# Altium schematic sheet VFD_13ST84GINK.SchDoc
size A3
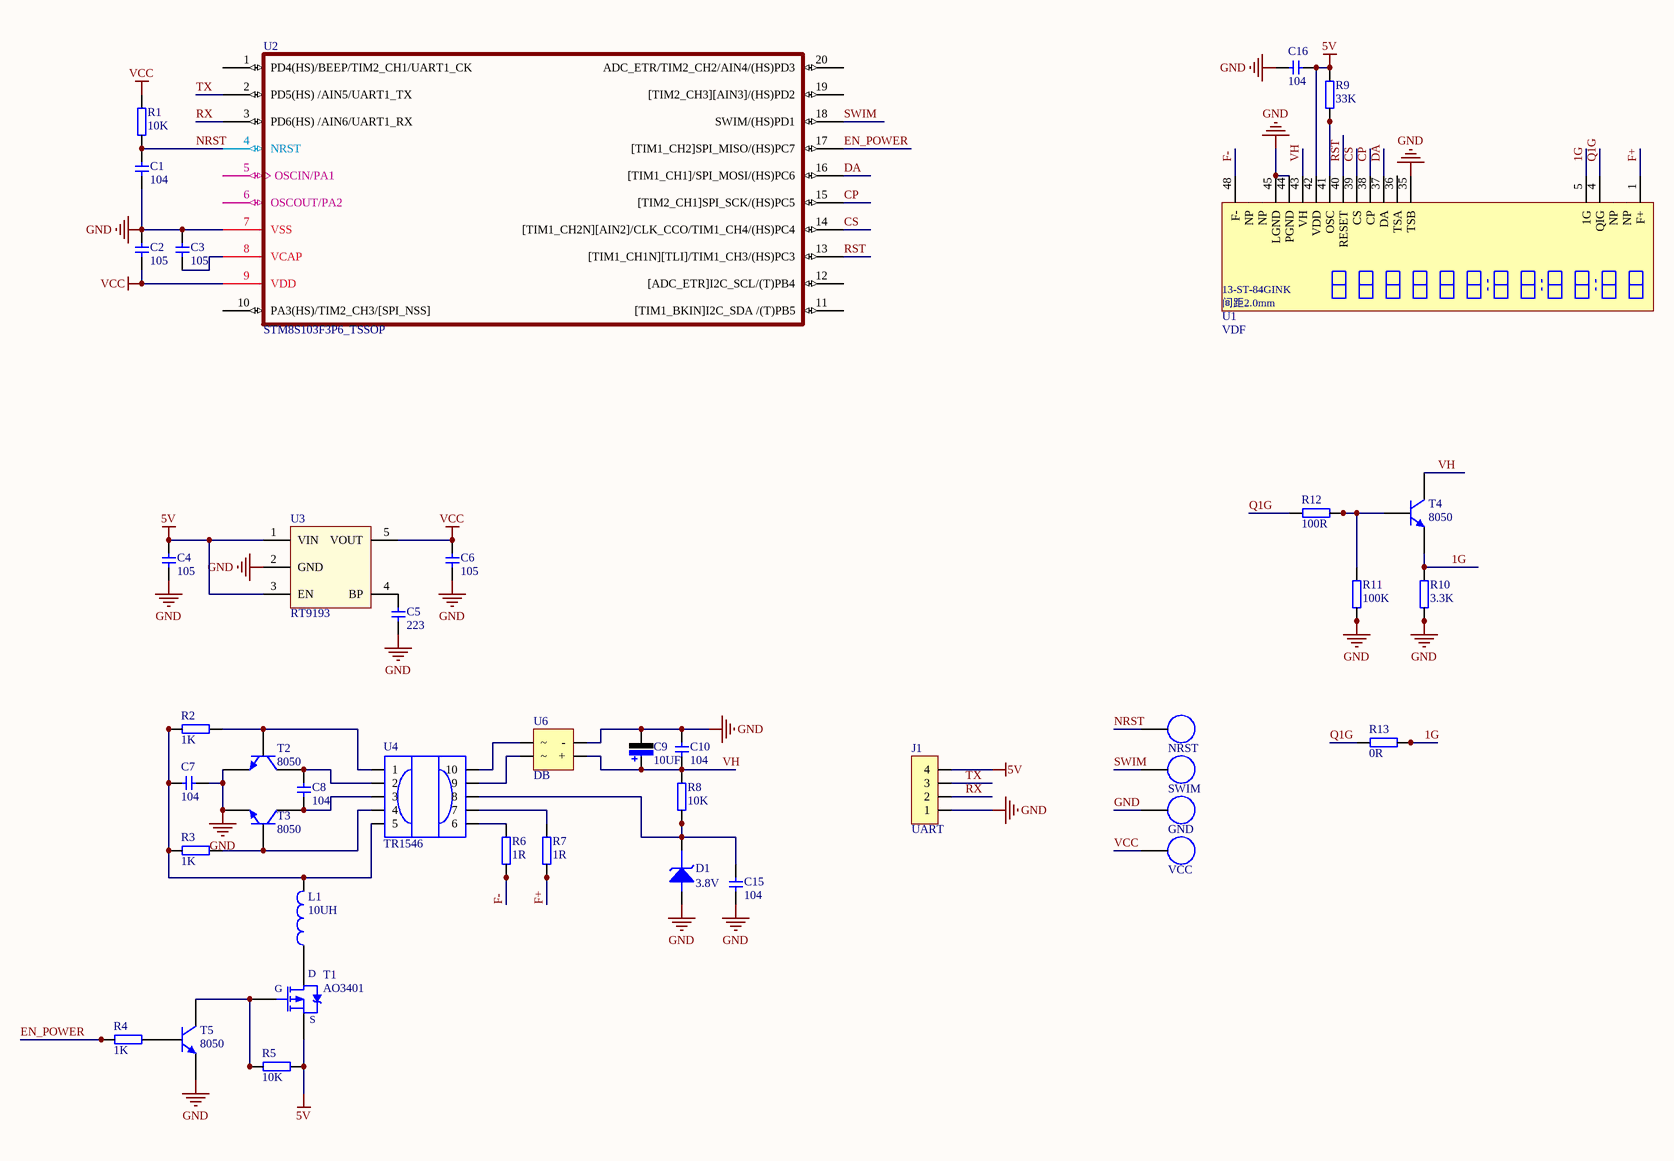
[diagram p0: VFD_13ST84GINK.SchDoc]

## Parts
C1  104  [C0603]
C2  105  [C0603]
C3  105  [C0603]
C4  105  [C0603]
C5  223  [C0603]
C6  105  [C0603]
C7  104  [C0805]
C8  104  [C0805]
C9  10UF  [C_SMD_5.0M]
C10  104  [C0805]
C15  104  [C0603]
C16  104  [C0603]
D1  3.8V  [LL-34]
GND  GND  [TP_SMT]
J1  UART  [PIN4]
L1  10UH  [L_6045]
NRST  TP  [TP_SMT]  (value not drawn)
R1  10K  [R0603]
R2  1K  [R0603]
R3  1K  [R0603]
R4  1K  [R0603]
R5  10K  [R0603]
R6  1R  [R0805]
R7  1R  [R0805]
R8  10K  [R0805]
R9  33K  [R0603]
R10  3.3K  [R0805]
R11  100K  [R0603]
R12  100R  [R0603]
R13  0R  [R0805]
SWIM  TP  [TP_SMT]  (value not drawn)
T1  AO3401  [SOT23]
T2  8050  [SOT23]
T3  8050  [SOT23]
T4  8050  [SOT23]
T5  8050  [SOT23]
U1  VDF  [VDF_13ST84GINK]
U2  STM8S103F3P6_TSSOP  [TSSOP20_T_U]
U3  RT9193  [SOT23-5]
U4  TR1546  [TR1546]
U6  DB  [SOIC-4]
VCC  TP  [TP_SMT]  (value not drawn)

## Nets
5V: C4.2 C16.1 J1.4 R5.2 R9.2 T1.2(S) U1.42(VDD) U3.1(VIN) U3.3(EN)
GND: C1.1 C2.2 C3.2 C4.1 C5.1 C6.1 C7.2 C9.2 C10.2 C15.1 C16.2 D1.1 GND.1 J1.1 R10.1 R11.1 T2.2(E) T3.2(E) T5.2(E) U1.35(TSB) U1.44(PGND) U1.45(LGND) U2.7(VSS) U3.2(GND) U6.4(-)
VCC: C2.1 C6.2 R1.2 U2.9(VDD) U3.5(VOUT) VCC.1
1G: R10.2 R13.1 T4.2(E) U1.5(1G)
CP: U1.38(CP) U2.15([TIM2_CH1]SPI_SCK/(HS)PC5)
CS: U1.39(CS) U2.14([TIM1_CH2N][AIN2]/CLK_CCO/TIM1_CH4/(HS)PC4)
DA: U1.37(DA) U2.16([TIM1_CH1]/SPI_MOSI/(HS)PC6)
EN_POWER: R4.1 U2.17([TIM1_CH2]SPI_MISO/(HS)PC7)
F+: R7.1 U1.1(F+)
F-: R6.1 U1.48(F-)
NRST: C1.2 NRST.1 R1.1 U2.4(NRST)
Q1G: R12.2 R13.2 U1.4(QIG)
RST: U1.40(RESET) U2.13([TIM1_CH1N][TLI]/TIM1_CH3/(HS)PC3)
RX: J1.2 U2.3(PD6(HS)_/AIN6/UART1_RX)
SWIM: SWIM.1 U2.18(SWIM/(HS)PD1)
TX: J1.3 U2.2(PD5(HS)_/AIN5/UART1_TX)
VH: C9.1 C10.1 R8.2 T4.3(C) U1.43(VH) U6.3(+)
NetC3_1: C3.1 U2.8(VCAP)
NetC5_2: C5.2 U3.4(BP)
NetC7_1: C7.1 L1.2 R2.1 R3.1 U4.5
NetC8_1: C8.1 T3.3(C) U4.3
NetC8_2: C8.2 T2.3(C) U4.2
NetC15_2: C15.2 D1.2 R8.1 U4.8
NetL1_1: L1.1 T1.3(D)
NetR2_2: R2.2 T2.1(B) U4.1
NetR3_2: R3.2 T3.1(B) U4.4
NetR4_2: R4.2 T5.1(B)
NetR5_1: R5.1 T1.1(G) T5.3(C)
NetR6_2: R6.2 U4.6
NetR7_2: R7.2 U4.7
NetR9_1: R9.1 U1.41(OSC)
NetR11_2: R11.2 R12.1 T4.1(B)
NetU4_9: U4.9 U6.2
NetU4_10: U4.10 U6.1

Not connected (* = marked no-connect by the designer): U1 2(NP) 3(NP) 36(TSA) 46(NP) 47(NP); U2 1(PD4(HS)/BEEP/TIM2_CH1/UART1_CK) 5(OSCIN/PA1) 6(OSCOUT/PA2) 10(PA3(HS)/TIM2_CH3/[SPI_NSS]) 11([TIM1_BKIN]I2C_SDA_/(T)PB5) 12([ADC_ETR]I2C_SCL/(T)PB4) 19([TIM2_CH3][AIN3]/(HS)PD2) 20(ADC_ETR/TIM2_CH2/AIN4/(HS)PD3)

## Notes on the sheet
- (in symbol VFD_13ST84GINK) 13-ST-84GINK; 间距2.0mm

## Library data of the parts
C1-C8 C10 C15 C16 = Cap
C9 = Cap+: 电解电容
D1 = DZ: 稳压二极管
GND NRST SWIM VCC = TP: 测试点
J1 = Pin4
L1 = L: 电感
R1-R13 = Res
T1 = MOS_P
T2 T4 T5 = T_NPN_8050: NPN三级管
T3 = T_NPN_8050_2: NPN三级管
U1 = VFD_13ST84GINK
U2 = STM8S103F3P6_TSSOP: TSSOP20
U3 = RT9193: 3.3V LDO
U4 = TR1546: VFD变压器
U6 = DB: 整流桥